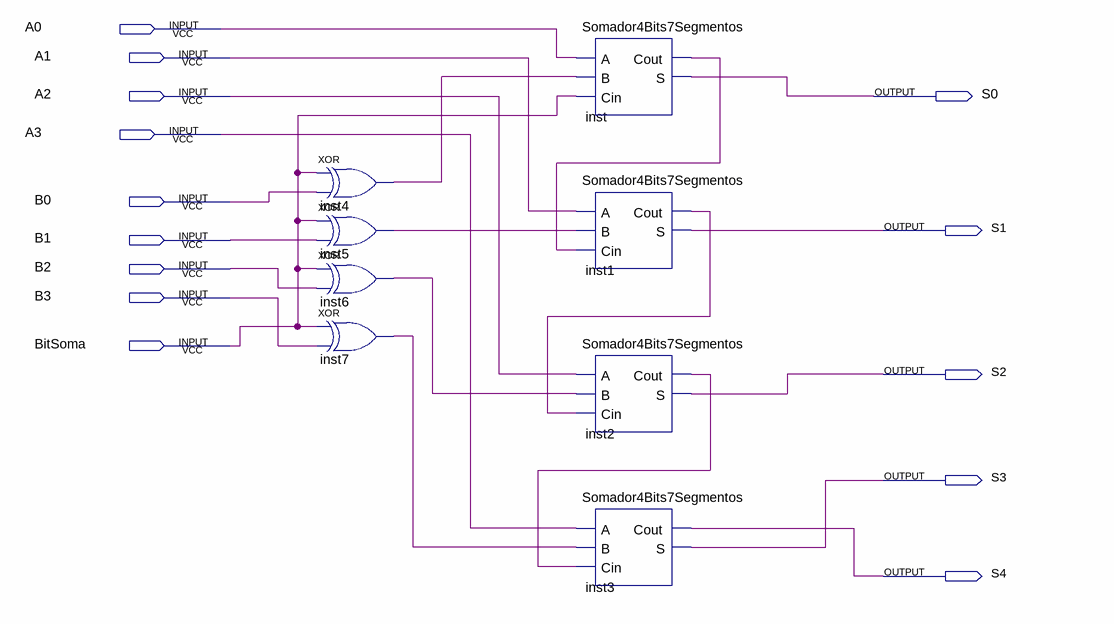
[diagram p0: schematic sheet]
// Quartus schematic Somador4BitsGrande.bdf as structural Verilog: 8 symbols, 14 pins
module Somador4BitsGrande (
  input  A0,
  input  A1,
  input  A2,
  input  A3,
  input  B0,
  input  B1,
  input  B2,
  input  B3,
  input  BitSoma,
  output S0,
  output S1,
  output S2,
  output S3,
  output S4
);

  wire inst1_cout, inst2_cout, inst4_out, inst5_out, inst6_out, inst7_out, inst_cout;

  xor inst4 (inst4_out, BitSoma, B0);
  xor inst5 (inst5_out, BitSoma, B1);
  xor inst6 (inst6_out, BitSoma, B2);
  xor inst7 (inst7_out, BitSoma, B3);
  Somador4Bits7Segmentos inst (.A(A0), .B(inst4_out), .Cin(BitSoma), .Cout(inst_cout), .S(S0));
  Somador4Bits7Segmentos inst1 (.A(A1), .B(inst5_out), .Cin(inst_cout), .Cout(inst1_cout), .S(S1));
  Somador4Bits7Segmentos inst2 (.A(A2), .B(inst6_out), .Cin(inst1_cout), .Cout(inst2_cout), .S(S2));
  Somador4Bits7Segmentos inst3 (.A(A3), .B(inst7_out), .Cin(inst2_cout), .Cout(S4), .S(S3));
endmodule
